# EAGLE schematic BottleNosePrototype (EAGLE 6.2)
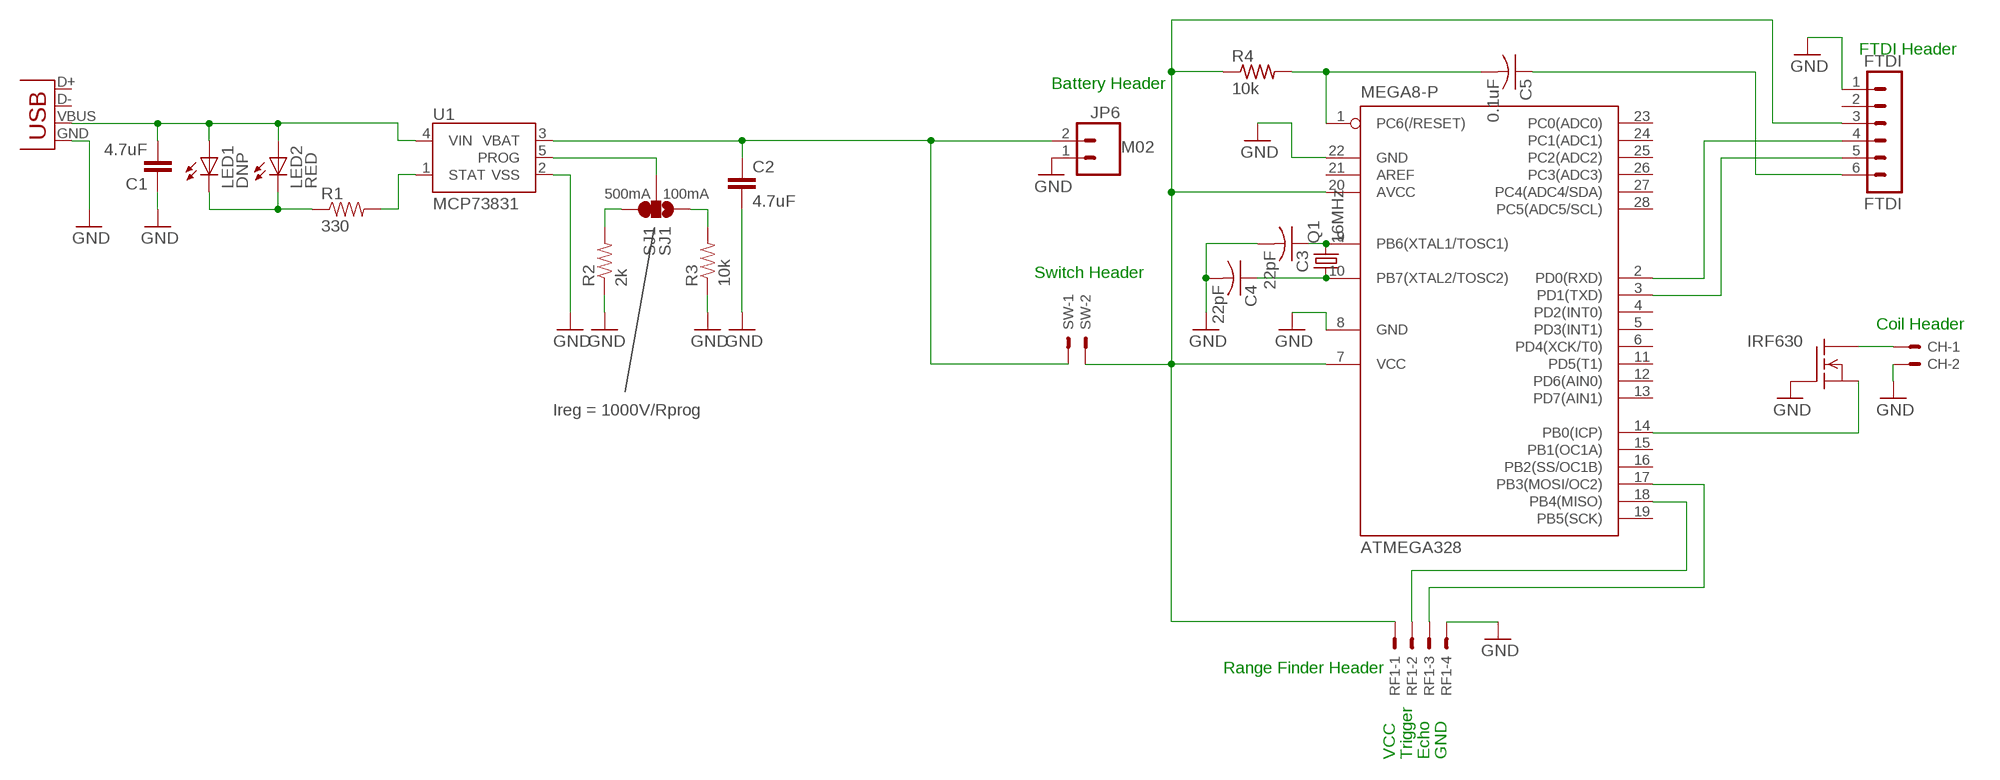
[diagram p0: schematic, sheet 1]

## Parts
ATMEGA328  MEGA8-P  [DIL28-3]
C1  4.7uF  CAP0402-CAP  [0402-CAP]
C2  4.7uF  CAP0402-CAP  [0402-CAP]
C3  22pF  C-US025-024X044  [C025-024X044]
C4  22pF  C-US025-024X044  [C025-024X044]
C5  0.1uF  C-US025-024X044  [C025-024X044]
CH  22-23-2021  [22-23-2021]
FTDI  FTDI  MA06-1  [MA06-1]
IRF630  IRF620  [TO220]
JP6  M02  M02PTH  [1X02]
LED1  DNP  LED3MM  [LED3MM]
LED2  RED  LED0603  [LED-0603]
Q1  16MHz  CRYSTALTC26V  [TC26V]
R1  330  RESISTOR0402-RES  [0402-RES]
R2  2k  RESISTOR0402-RES  [0402-RES]
R3  10k  RESISTOR0402-RES  [0402-RES]
R4  10k  R-US_0204/5  [0204/5]
RF1  22-23-2041  [22-23-2041]
SJ1  SJ1  SOLDERJUMPER_2WAYS  [SJ_3]
SW  22-23-2021  [22-23-2021]
U1  MCP73831  [SOT23-5]
X2  USBSMD  [USB-MINIB]

## Nets
GND: ATMEGA328.8(GND) ATMEGA328.22(GND) C1.1 C2.2 C3.2 C4.2 CH.2 FTDI.1 IRF630.1(G) JP6.1 R2.1 R3.1 RF1.4 U1.2(VSS) X2.GND
N$1: CH.1 IRF630.2(D)
N$2: R1.2 U1.1(STAT)
N$3: LED1.K(C) LED2.C R1.1
N$4: R2.2 SJ1.3
N$5: ATMEGA328.7(VCC) ATMEGA328.20(AVCC) FTDI.3 R4.1 RF1.1 SW.2
N$6: C2.1 JP6.2 SW.1 U1.3(VBAT)
N$7: R3.2 SJ1.1
N$8: ATMEGA328.9(PB6(XTAL1/TOSC1)) C3.1 Q1.2
N$9: ATMEGA328.18(PB4(MISO)) RF1.2
N$10: ATMEGA328.14(PB0(ICP)) IRF630.3(S)
N$12: ATMEGA328.10(PB7(XTAL2/TOSC2)) C4.1 Q1.1
N$13: ATMEGA328.17(PB3(MOSI/OC2)) RF1.3
N$14: ATMEGA328.2(PD0(RXD)) FTDI.4
N$15: ATMEGA328.3(PD1(TXD)) FTDI.5
N$17: C5.1 FTDI.6
N$18: ATMEGA328.1(PC6(/RESET)) C5.2 R4.2
N$24: C1.2 LED1.A LED2.A U1.4(VIN) X2.VBUS
PROG: SJ1.2 U1.5(PROG)
Unconnected: ATMEGA328.4(PD2(INT0)) ATMEGA328.5(PD3(INT1)) ATMEGA328.6(PD4(XCK/T0)) ATMEGA328.11(PD5(T1)) ATMEGA328.12(PD6(AIN0)) ATMEGA328.13(PD7(AIN1)) ATMEGA328.15(PB1(OC1A)) ATMEGA328.16(PB2(SS/OC1B)) ATMEGA328.19(PB5(SCK)) ATMEGA328.21(AREF) ATMEGA328.23(PC0(ADC0)) ATMEGA328.24(PC1(ADC1)) ATMEGA328.25(PC2(ADC2)) ATMEGA328.26(PC3(ADC3)) ATMEGA328.27(PC4(ADC4/SDA)) ATMEGA328.28(PC5(ADC5/SCL)) FTDI.2 X2.D+ X2.D-

## Notes on the sheet
- FTDI Header
- Battery Header
- 500mA | 100mA
- Switch Header
- Coil Header
- Ireg = 1000V/Rprog
- Range Finder Header
- VCC | Trigger | Echo | GND

## Library data of the parts
ATMEGA328 = atmel:MEGA8-P: MICROCONTROLLER 8 Kbytes FLASH, 1 kbytes SRAM, 512 bytes EEPROM, USART, 4-channel 10 bit ADC, 2-channel 8 bit ADC Pin compatible with Atmega48, ATMega88, ATMega168 Source: avr.lbr; OC_FARNELL: unknown; OC_NEWARK: unknown
C1 C2 = SparkFun:CAP: Capacitor Standard 0603 ceramic capacitor, and 0.1" leaded capacitor.
C3-C5 = rcl:C-US: CAPACITOR, American symbol
CH SW = con-molex:22-23-2021: .100" (2.54mm) Center Header - 2 Pin; MF: MOLEX; MPN: 22-23-2021; OC_FARNELL: 1462926; OC_NEWARK: 25C3832
FTDI = con-lstb:MA06-1: PIN HEADER; OC_FARNELL: unknown; OC_NEWARK: unknown
IRF630 = transistor-fet:IRF620: N-Channel Enhancement MOSFET (HEXFET); 200V; 5,2A; 0,8Ohm
JP6 = SparkFun:M02: Header 2 Standard 2-pin 0.1" header. Use with straight break away headers (SKU : PRT-00116), right angle break away headers (PRT-00553), swiss pins (PRT-00743), machine pins (PRT-00117), and female headers (PRT-00115). Molex polarized connector foot print use with SKU : PRT-08233 with associated crimp pins and housings.
LED1 LED2 = SparkFun:LED: LEDs Standard schematic elements and footprints for 5mm, 3mm, 1206, and 0603 sized LEDs. 5mm - Spark Fun Electronics SKU : COM-00529 (and others)
Q1 = crystal:CRYSTAL: CRYSTAL; OC_FARNELL: unknown; OC_NEWARK: unknown
R1-R3 = SparkFun:RESISTOR: Resistor Basic schematic elements and footprints for 0603, 1206, and PTH resistors.
R4 = resistor:R-US_: RESISTOR, American symbol
RF1 = con-molex:22-23-2041: .100" (2.54mm) Center Header - 4 Pin; MF: MOLEX; MPN: 22-23-2041; OC_FARNELL: 1462920; OC_NEWARK: 38C0355
SJ1 = SparkFun:SOLDERJUMPER_2WAY: Solder Jumper 2 way solder jumper
U1 = SparkFun:MCP73831: Microchip's MCP73831 Miniature single cell, fully integrated Li-Ion, Li-polymer charge management controller http://ww1.microchip.com/downloads/en/DeviceDoc/21984a.pdf
X2 = SparkFun:USB: USB Connectors USB-B-PTH is fully proven SKU : PRT-00139 USB-miniB is fully proven SKU : PRT-00587 USB-A-PCB is untested. USB-A-H is throughly reviewed, but untested. Spark Fun Electronics SKU : PRT-00437 USB-B-SMT is throughly reviewed, but untested. Needs silkscreen touching up. USB-A-S has not been used/tested USB-MB-H has not been used/tested